# Altium schematic sheet 10-MODEM.SchDoc
size A4
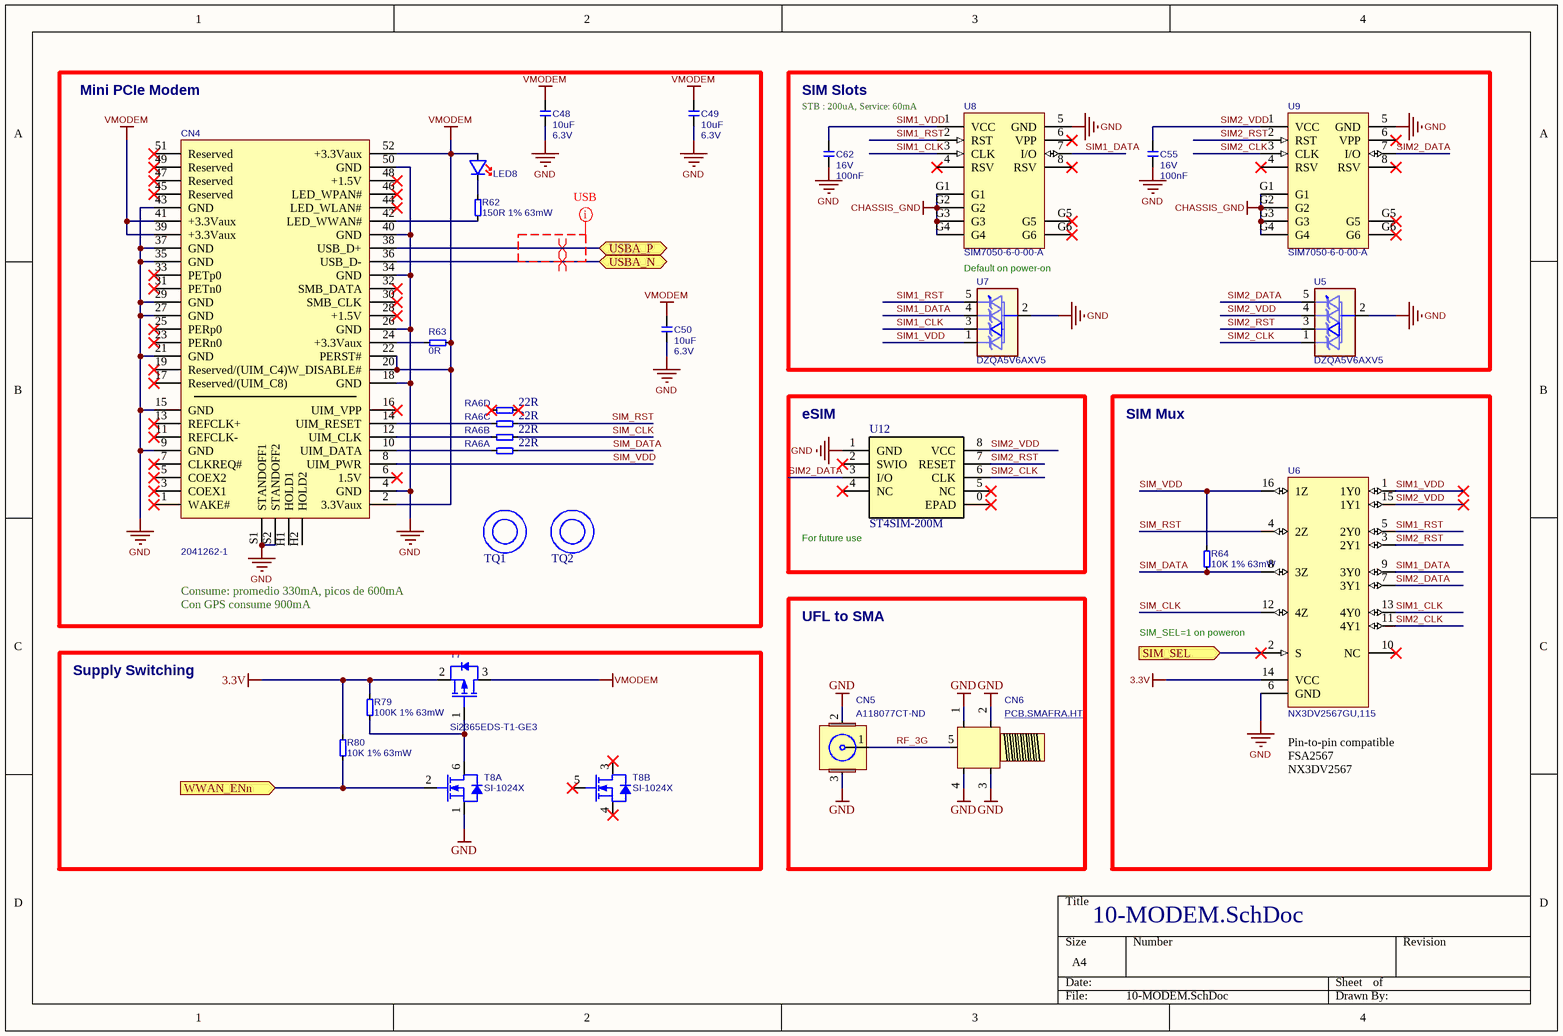
[diagram p0: 10-MODEM.SchDoc]

## Parts
C48  value 10uF  Rating: 6.3V  [T_CAPC0603X33N]  (hidden comment: 10uF 6.3V 20% X5R)
C49  value 10uF  Rating: 6.3V  [T_CAPC0603X33N]  (hidden comment: 10uF 6.3V 20% X5R)
C50  value 10uF  Rating: 6.3V  [T_CAPC0603X33N]  (hidden comment: 10uF 6.3V 20% X5R)
C55  value 100nF  Rating: 16V  [CAPC1005X60N]  (hidden comment: 100nF 16V 10% X7R)
C62  value 100nF  Rating: 16V  [CAPC1005X60N]  (hidden comment: 100nF 16V 10% X7R)
CN4  2041262-1  [2041262-1]
CN5  A118077CT-ND  [U.FL-R-SMT-1]
CN6  PCB.SMAFRA.HT  [0733910320]
LED8  150060RS75000  [LEDC1608X80N]  (value not drawn)
R62  150R 1% 63mW  [RESC1005X40N]
R63  0R  [RESC1005X40N]
R64  10K 1% 63mW  [RESC1005X40N]
R79  100K 1% 63mW  [RESC1005X40N]
R80  10K 1% 63mW  [RESC1005X40N]
RA6  22R  [T_Resistor_Array_X4]  (parts A,B,C,D of 4)
T7  Si2365EDS-T1-GE3  [SOT95P230X110-3N]
T8  SI-1024X  [SOTFL50P160X60-6N]  (parts A,B of 2)
TQ1  9774040243R  (value not drawn)  (mechanical)
TQ2  9774040243R  (value not drawn)  (mechanical)
U5  DZQA5V6AXV5  [SOTFL50P162X62-5N]
U6  NX3DV2567GU,115  [XFQFN-16]
U7  DZQA5V6AXV5  [SOTFL50P162X62-5N]
U8  SIM7050-6-0-00-A  [SIM7050-8-0-00-X_revC]
U9  SIM7050-6-0-00-A  [SIM7050-8-0-00-X_revC]
U12  ST4SIM-200M  [ST4SIM-200M]

## Blocks framed on the sheet
Mini PCIe Modem: C48-C50 CN4 LED8 R62 R63 RA6 TQ1 TQ2
SIM Slots: C55 C62 U5 U7-U9
eSIM: U12
SIM Mux: R64 U6
UFL to SMA: CN5 CN6
Supply Switching: R79 R80 T7 T8

## Ports
SIM_SEL (in), USBA_N (bidir), USBA_P (bidir), WWAN_ENn (in)

## Nets
3.3V: R79.2 R80.2 T7.2(D) U6.14(VCC)
CHASSIS_GND: U8.G1 U8.G2 U8.G3 U8.G4 U9.G1 U9.G2 U9.G3 U9.G4
GND: C48.2 C49.2 C50.2 C55.2 C62.2 CN4.4(GND) CN4.9(GND) CN4.15(GND) CN4.18(GND) CN4.21(GND) CN4.26(GND) CN4.27(GND) CN4.29(GND) CN4.34(GND) CN4.35(GND) CN4.37(GND) CN4.40(GND) CN4.43(GND) CN4.50(GND) CN4.S1(STANDOFF1) CN4.S2(STANDOFF2) CN5.2(GND) CN5.3(GND) CN6.1(GND) CN6.2(GND) CN6.3(GND) CN6.4(GND) T8.1(S) U5.2 U6.6(GND) U7.2 U8.5(GND) U9.5(GND) U12.1(GND)
VMODEM: C48.1 C49.1 C50.1 CN4.2(3.3Vaux) CN4.20(W_DISABLE#) CN4.22(PERST#) CN4.39(+3.3Vaux) CN4.41(+3.3Vaux) CN4.52(+3.3Vaux) LED8.2 R63.1 T7.3(S)
RF_3G: CN5.1(SIG) CN6.5(SIG)
SIM1_CLK: U6.13(4Y0) U7.3 U8.3(CLK)
SIM1_DATA: U6.9(3Y0) U7.4 U8.7(I/O)
SIM1_RST: U6.5(2Y0) U7.5 U8.2(RST)
SIM1_VDD: C62.1 U6.1(1Y0) U7.1 U8.1(VCC)
SIM2_CLK: U5.1 U6.11(4Y1) U9.3(CLK) U12.6(CLK)
SIM2_DATA: U5.5 U6.7(3Y1) U9.7(I/O) U12.3(I/O)
SIM2_RST: U5.3 U6.3(2Y1) U9.2(RST) U12.7(RESET)
SIM2_VDD: C55.1 U5.4 U6.15(1Y1) U9.1(VCC) U12.8(VCC)
SIM_CLK: RA6.6 U6.12(4Z)
SIM_DATA: R64.1 RA6.5 U6.8(3Z)
SIM_RST: RA6.7 U6.4(2Z)
SIM_SEL: U6.2(S) ; port SIM_SEL
SIM_VDD: CN4.8(UIM_PWR) R64.2 U6.16(1Z)
USBA_N: CN4.36(USB_D-) ; port USBA_N
USBA_P: CN4.38(USB_D+) ; port USBA_P
WWAN_ENn: R80.1 T8.2(G) ; port WWAN_ENn
NetCN4_10: CN4.10(UIM_DATA) RA6.1
NetCN4_12: CN4.12(UIM_CLK) RA6.2
NetCN4_14: CN4.14(UIM_RESET) RA6.3
NetCN4_24: CN4.24(+3.3Vaux) R63.2
NetCN4_42: CN4.42(LED_WWAN#) R62.2
NetLED8_1: LED8.1 R62.1
NetR79_1: R79.1 T7.1(G) T8.6(D)

Not connected (* = marked no-connect by the designer): CN4 1(WAKE#)* 3(COEX1)* 5(COEX2)* 6(1.5V)* 7(CLKREQ#)* 11(REFCLK-)* 13(REFCLK+)* 16(UIM_VPP)* 17(Reserved/(UIM_C8))* 19(Reserved/(UIM_C4))* 23(PERn0)* 25(PERp0)* 28(+1.5V)* 30(SMB_CLK)* 31(PETn0)* 32(SMB_DATA)* 33(PETp0)* 44(LED_WLAN#)* 45(Reserved)* 46(LED_WPAN#)* 47(Reserved)* 48(+1.5V)* 49(Reserved)* 51(Reserved)* H1(HOLD1) H2(HOLD2); RA6 4* 8*; T8 3(D)* 4(S)* 5(G)*; U6 10(NC)*; U8 4(RSV)* 6(VPP)* 8(RSV)* G5* G6*; U9 4(RSV)* 6(VPP)* 8(RSV)* G5* G6*; U12 0(EPAD)* 2(SWIO)* 4(NC)* 5(NC)*

## Layout directives
net class USB: (no net found under the mark)
differential pair: USBA_N, USBA_P

## Notes on the sheet
- STB : 200uA, Service: 60mA
- Default on power-on
- (near U12) For future use
- Consume: promedio 330mA, picos de 600mA
- Con GPS consume 900mA
- SIM_SEL=1 on poweron
- (near U6) Pin-to-pin compatible
  FSA2567
  NX3DV2567

## Library data of the parts
C48-C50 = C-10uF-6.3V-20%-0603: Capacitor Ceramic X5R 10uF 6.3V 20% 0603; Type: X7R; FP_DESC: C0603; Tolerance: 20%; Supplier 1: Digi-Key; Supplier Part Number 1: 490-3896-1-ND; MFG: *; MFG_PN: *
C55 C62 = C-100nF-16V-10%-0603: Capacitor Ceramic X7R 100nF 16V 10% 0603; FP_DESC: C0402; Tolerance: 10%; Type: X7R; Supplier 1: Digi-Key; Supplier Part Number 1: 1276-1001-1-ND; Footprint Checked: -; MFG: *; MFG_PN: *
CN4 = CON-TE-2041262-1: 52 Position Female Connector PCI Express Mini Card Gold 0.031" (0.80mm) Black; FP_DESC: miniPCIe; MFG: TE; Symbol Checked: Ok; MFG_PN: 2041262-1; Footprint Checked: Assign OK, Footprint OK; Supplier 1: Digi-Key; Supplier Part Number 1: A125147CT-ND
CN5 = CON-TE-A118077CT-ND: U.FL (UMCC) Connector Jack, Male Pin 50Ohm Surface Mount Solder; MFG: TE Connectivity AMP Connectors; FP_DESC: U.FL connector; Symbol Checked: Ok; MFG_PN: A118077CT-ND; Footprint Checked: Assign OK, Footprint OK; Supplier 1: Digi-Key; Supplier Part Number 1: A118077DKR-ND
CN6 = CON-Taoglas-PCB.SMAFRA.HT: SMA Connector Jack, Female Socket 50Ohm Through Hole, Right Angle Solder; FP_DESC: SMA, Right angle; MFG: Taoglas Limited; Symbol Checked: Ok; Footprint Checked: Assign OK, Footprint OK; Supplier 1: Digi-Key; Supplier Part Number 1: 931-1361-ND; MFG_PN: PCB.SMAFRA.HT
LED8 = LED-RED-0603: Red 625nm LED Indication - Discrete 2V 0603 (1608 Metric); MFG: Würth Elektronik; MFG_PN: 150060RS75000; Color: Red; Supplier 1: Digi-Key; Supplier Part Number 1: 732-4978-1-ND; Footprint Checked: -; Symbol Checked: -
R62 = R-150R-1%-0402: Resistor 150ohm 63mW 1% 0402; MFG: <GENERIC>; Power: 63mW; Tolerance: 1%; Value: 150R; Footprint: R0402; Supplier 1: Digi-Key; Supplier Part Number 1: 541-CRCW0402150RFKTDCT-ND; Footprint Checked: -; Symbol Checked: -; MFG_PN: <GENERIC>
R63 = R-0R-0402: Resistor 0ohm 0402; Tolerance: 1%; MFG: <GENERIC>; Power: ?; Value: 0R; Footprint: R0402; Supplier 1: Digi-Key; Supplier Part Number 1: 541-2952-1-ND; Footprint Checked: -; Symbol Checked: -; MFG_PN: <GENERIC>
R64 R80 = R-10K-1%-0402: Resistor 10Kohm 63mW 1% 0402; MFG: <GENERIC>; Power: 63mW; Tolerance: 1%; Value: 10k; Footprint: R0402; Supplier 1: Digi-Key; Supplier Part Number 1: 541-10.0KLDKR-ND; Footprint Checked: -; Symbol Checked: -; MFG_PN: <GENERIC>
R79 = R-100K-1%-0402: Resistor 100Kohm 63mW 1% 0402; Manufacturer: <GENERIC>; Replacement Allowed: Yes; Power: 63mW; Tolerance: 1%; Value: 100k; Footprint: R0402; Supplier 1: Digi-Key; Supplier Part Number 1: 541-100KLCT-ND; Manufacturer Part Number: <GENERIC>
RA6 = RA-22R-5%-1206-div: Resistor Array 22 R 63mW 5% 1206; MFG: Generic; Tolerance: 5%; Power Dissipation: 63mW; Supplier 1: Digi-Key; Supplier Part Number 1: TC164J-22CT-ND; Value: 22R; Footprint Checked: -; Symbol Checked: -
T7 = T-Vishay-Si2365EDS: MOSFET, P channel Vishay Si2365EDS-T1-GE3; FP_DESC: SOT23-3; MFG: VISHAY; MFG_PN: Si2365EDS-T1-GE3; Footprint Checked: -; Symbol Checked: -; Supplier 1: Digi-Key; Supplier Part Number 1: SI2365EDS-T1-GE3CT-ND
T8 = T-Vishay-SI-1024X: Mosfet Array 2 N-Channel (Dual) 20V 485mA 250mW Surface Mount SC-89-6; MFG: Vishay; MFG_PN: SI-1024-X; Supplier 1: Digi-Key; Supplier Part Number 1: SI1024X-T1-GE3CT-ND; Footprint Checked: -; Symbol Checked: -
TQ1 TQ2 = MECH-Wurth-9774040243R: ROUND STANDOFF M2X0.4 STEEL 4MM; MFG: Wurth; Footprint Checked: -; Symbol Checked: -; MFG_PN: 9774040243R; Supplier 1: Digi-Key; Supplier Part Number 1: 732-7090-1-ND
U5 U7 = D-DZQA5V6AXV5: 13V Clamp 2.5A (8/20µs) Ipp Tvs Diode Surface Mount 5-TSSOP; FP_DESC: SOT553; MFG: DIODES; Symbol Checked: Ok; MFG_PN: DZQA5V6AXV5; Footprint Checked: Assign OK, Footprint OK; Supplier 1: Digi-Key; Supplier Part Number 1: DZQA5V6AXV5DICT-ND
U6 = IC-NXP-NX3DV2567: Networking Switch IC 1 Channel 16-XQFN (1.8x2.6); MFG: NXP; Symbol Checked: D; MFG_PN: NX3DV2567GU,115; Footprint Checked: -; FP_DESC: XFQFN-16; Supplier 1: Digi-Key; Supplier Part Number 1: 568-5206-1-ND
U8 U9 = CON-Molex-115I-AEAA: MICRO SIM PUSH-PUSH, 6P, SMT, 1.; FP_DESC: microSIM card holder; MFG: GCT; Symbol Checked: Ok; Replacement Allowed: Ask; MFG_PN: SIM7050-6-0-00-A; Footprint Checked: Assign OK, Footprint OK; Supplier 1: Digi-Key; Supplier Part Number 1: 2073-SIM7050-6-0-00-ACT-ND
U12 = IC-ST-ST4SIM-200M: ESIM SYSTEM ON CHIP FOR M2M INDU; MFG: STMicroelectronics; MFG_PN: ST4SI2M0004TPIFW; Type: DEV; Footprint Checked: -; Symbol Checked: -